# Altium schematic sheet Input.SchDoc: Input
size A; DrawnBy: Austin Hendrix
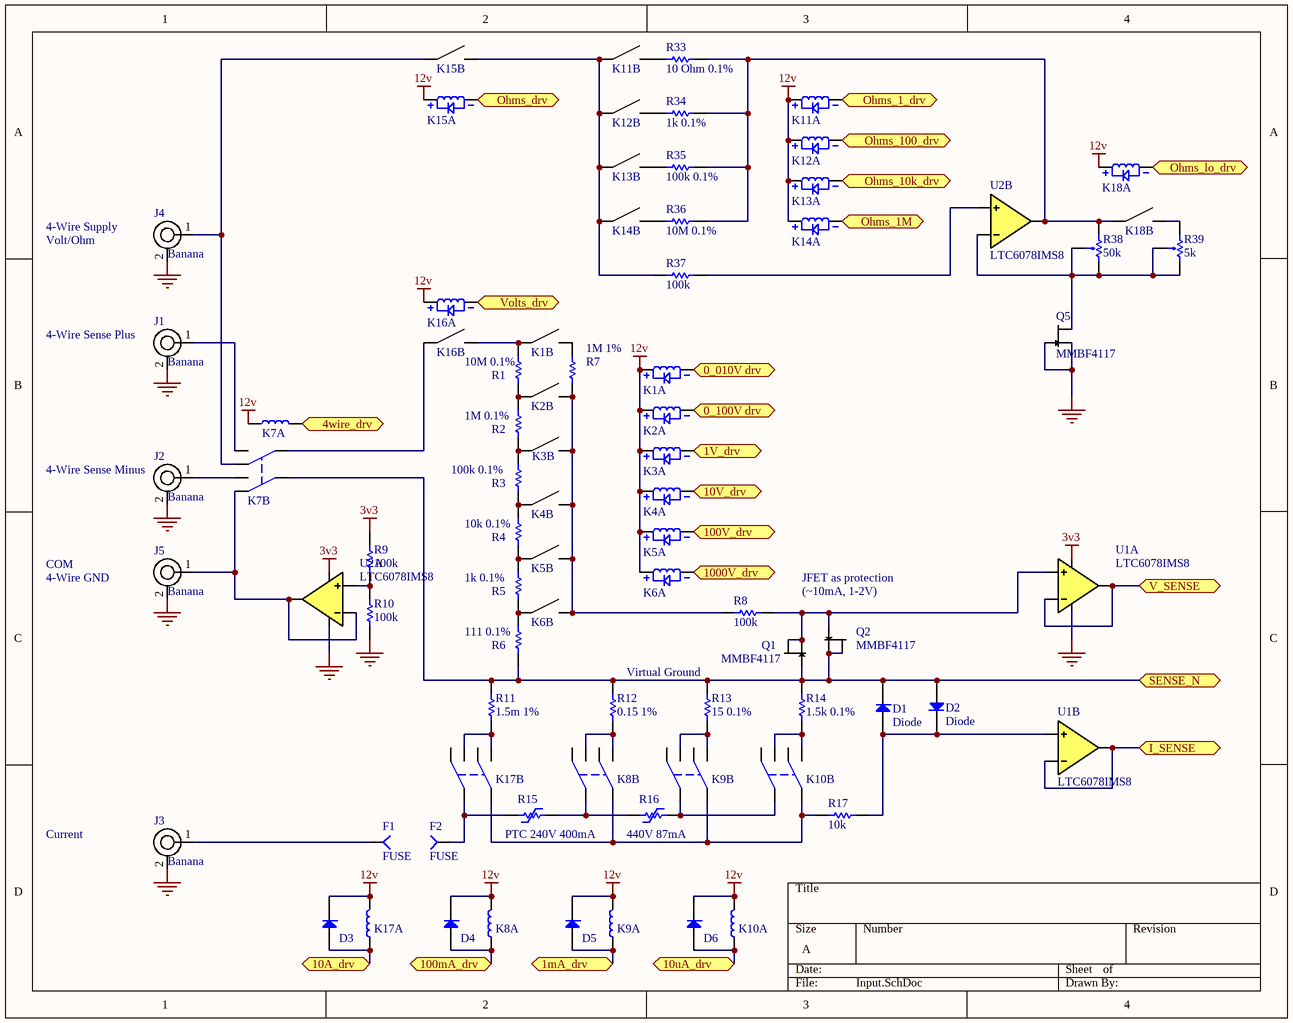
[diagram p0: Input.SchDoc]

## Parts
D1  Diode  [SOD80]
D2  Diode  [SOD80]
D3  Diode  [SOD80]  (value not drawn)
D4  Diode  [SOD80]  (value not drawn)
D5  Diode  [SOD80]  (value not drawn)
D6  Diode  [SOD80]  (value not drawn)
F1  FUSE  [FUSE CLIP]
F2  FUSE  [FUSE CLIP]
J1  Banana  [FCR7350]
J2  Banana  [FCR7350]
J3  Banana  [FCR7350]
J4  Banana  [FCR7350]
J5  Banana  [FCR7350]
K1  Relay Reed SPST 1000V / 500mA 12V  [Coto 9104-12-11]  (value not drawn)  (parts A,B of 2)
K2  Relay Reed SPST 500mA 12V  [HE3621A]  (value not drawn)  (parts A,B of 2)
K3  Relay Reed SPST 500mA 12V  [HE3621A]  (value not drawn)  (parts A,B of 2)
K4  Relay Reed SPST 500mA 12V  [HE3621A]  (value not drawn)  (parts A,B of 2)
K5  Relay Reed SPST 500mA 12V  [HE3621A]  (value not drawn)  (parts A,B of 2)
K6  Relay Reed SPST 500mA 12V  [HE3621A]  (value not drawn)  (parts A,B of 2)
K7  Relay DPDT 15A 12V  [K10-pcb]  (value not drawn)  (parts A,B of 2)
K8  Relay DPDT 2A 12V  [EE2-12NU]  (value not drawn)  (parts A,B of 2)
K9  Relay DPDT 2A 12V  [EE2-12NU]  (value not drawn)  (parts A,B of 2)
K10  Relay DPDT 2A 12V  [EE2-12NU]  (value not drawn)  (parts A,B of 2)
K11  Relay Reed SPST 500mA 12V  [HE3621A]  (value not drawn)  (parts A,B of 2)
K12  Relay Reed SPST 500mA 12V  [HE3621A]  (value not drawn)  (parts A,B of 2)
K13  Relay Reed SPST 500mA 12V  [HE3621A]  (value not drawn)  (parts A,B of 2)
K14  Relay Reed SPST 500mA 12V  [HE3621A]  (value not drawn)  (parts A,B of 2)
K15  Relay Reed SPST 500mA 12V  [HE3621A]  (value not drawn)  (parts A,B of 2)
K16  Relay Reed SPST 1000V / 500mA 12V  [Coto 9104-12-11]  (value not drawn)  (parts A,B of 2)
K17  Relay DPDT 15A 12V  [K10-pcb]  (value not drawn)  (parts A,B of 2)
K18  Relay Reed SPST 500mA 12V  [HE3621A]  (value not drawn)  (parts A,B of 2)
Q1  MMBF4117  [SOT_23]
Q2  MMBF4117  [SOT_23]
Q5  MMBF4117  [SOT_23]
R1  10M 0.1%  [R2010]
R2  1M 0.1%  [R1206]
R3  100k 0.1%  [R0805]
R4  10k 0.1%  [R0603]
R5  1k 0.1%  [R0603]
R6  111 0.1%  [R0402]
R7  1M 1%  [R2512]
R8  100k  [R0603]
R9  100k  [R0603]
R10  100k  [R0603]
R11  1.5m 1%  [R2512]
R12  0.15 1%  [R2010]
R13  15 0.1%  [R0805]
R14  1.5k 0.1%  [R0603]
R15  PTC 240V 400mA  [0ZRE0040FF1A]
R16  440V 87mA  [B59751C0120A070]
R17  10k  [R0603]
R33  10 Ohm 0.1%  [R0603]
R34  1k 0.1%  [R0603]
R35  100k 0.1%  [R0805]
R36  10M 0.1%  [R1206]
R37  100k  [R0603]
R38  50k  [PV36]
R39  5k  [PV36]
U1  LTC6078IMS8  [8MSOP]  (parts A,B of 2)
U2  LTC6078IMS8  [8MSOP]  (parts A,B of 2)

## Ports
0_010V drv, 0_100V drv, 1mA_drv, 1V_drv, 4wire_drv, 10A_drv, 10uA_drv, 10V_drv, 100mA_drv, 100V_drv, 1000V_drv, I_SENSE, Ohms_1_drv, Ohms_1M, Ohms_10k_drv, Ohms_100_drv, Ohms_drv, Ohms_lo_drv, SENSE_N, V_SENSE, Volts_drv

## Nets
3v3: R9.2 U1.8 U2.8
12v: D3.2(K) D4.2(K) D5.2(K) D6.2(K) K1.3 K2.2 K3.2 K4.2 K5.2 K6.2 K7.7 K8.12 K9.12 K10.12 K11.2 K12.2 K13.2 K14.2 K15.2 K16.3 K17.8 K18.2
GND: J1.2 J2.2 J3.2 J4.2 J5.2 Q5.1 Q5.3 R10.1 U1.4 U2.4
0_010V drv: K1.5 ; port 0_010V drv
0_100V drv: K2.3 ; port 0_100V drv
1mA_drv: D5.1(A) K9.1 ; port 1mA_drv
1V_drv: K3.3 ; port 1V_drv
4wire_drv: K7.8 ; port 4wire_drv
10A_drv: D3.1(A) K17.7 ; port 10A_drv
10uA_drv: D6.1(A) K10.1 ; port 10uA_drv
10V_drv: K4.3 ; port 10V_drv
100mA_drv: D4.1(A) K8.1 ; port 100mA_drv
100V_drv: K5.3 ; port 100V_drv
1000V_drv: K6.3 ; port 1000V_drv
I_SENSE: U1.6 U1.7 ; port I_SENSE
Ohms_1_drv: K11.3 ; port Ohms_1_drv
Ohms_1M: K14.3 ; port Ohms_1M
Ohms_10k_drv: K13.3 ; port Ohms_10k_drv
Ohms_100_drv: K12.3 ; port Ohms_100_drv
Ohms_drv: K15.3 ; port Ohms_drv
Ohms_lo_drv: K18.3 ; port Ohms_lo_drv
SENSE_N: D1.2(K) D2.1(A) K7.6 Q1.3 Q2.1 Q2.2 R6.1 R11.2 R12.2 R13.2 R14.2 ; port SENSE_N
V_SENSE: U1.1 U1.2 ; port V_SENSE
Volts_drv: K16.5 ; port Volts_drv
NetD1_1: D1.1(A) D2.2(K) R17.2 U1.5
NetF1_1: F1.1 J3.1
NetF2_1: F2.1 K17.6 R15.1
NetJ1_1: J1.1 K7.3
NetJ2_1: J2.1 K7.4
NetJ4_1: J4.1 K7.1 K15.1
NetJ5_1: J5.1 K7.2 U2.1 U2.2
NetK1_1: K1.1 K16.7 R1.2
NetK1_7: K1.7 R7.2
NetK2_1: K2.1 R1.1 R2.2
NetK2_4: K2.4 K3.4 K4.4 K5.4 K6.4 R7.1 R8.1
NetK3_1: K3.1 R2.1 R3.2
NetK4_1: K4.1 R3.1 R4.2
NetK5_1: K5.1 R4.1 R5.2
NetK6_1: K6.1 R5.1 R6.2
NetK7_5: K7.5 K16.1
NetK8_4: K8.4 R15.2 R16.1
NetK8_5: K8.5 K8.8 R12.1
NetK8_9: K8.9 K9.9 K10.9 K17.5 R17.1
NetK9_4: K9.4 K10.4 R16.2
NetK9_5: K9.5 K9.8 R13.1
NetK10_5: K10.5 K10.8 R14.1
NetK11_1: K11.1 K12.1 K13.1 K14.1 K15.4 R37.1
NetK11_4: K11.4 R33.1
NetK12_4: K12.4 R34.1
NetK13_4: K13.4 R35.1
NetK14_4: K14.4 R36.1
NetK17_3: K17.3 K17.4 R11.1
NetK18_1: K18.1 R33.2 R34.2 R35.2 R36.2 R38.3 U2.7
NetK18_4: K18.4 R39.3
NetQ1_1: Q1.1 Q1.2 Q2.3 R8.2 U1.3
NetQ5_2: Q5.2 R38.1 R38.2 R39.1 R39.2 U2.6
NetR9_1: R9.1 R10.2 U2.3
NetR37_2: R37.2 U2.5

Not connected (* = marked no-connect by the designer): K8 3 10; K9 3 10; K10 3 10; K17 1 2

## Notes on the sheet
- (near J4) 4-Wire Supply
- Volt/Ohm
- (near J1) 4-Wire Sense Plus
- (near J2) 4-Wire Sense Minus
- COM
- 4-Wire GND
- JFET as protection
- (~10mA, 1-2V)
- Virtual Ground
- Current

## Library data of the parts
D1 D2 = Diode 125V 200mA: DIODE GEN PURP 125V 200MA LL34; Supplier 1: Digi-Key; Supplier Part Number 1: FDLL3595CT-ND
D3-D6 = Diode 100V 200mA: DIODE GEN PURP 100V 200MA LL34; Supplier 1: Digi-Key; Supplier Part Number 1: FDLL4148CT-ND
F1 F2 = FUSE CLIP: FUSE CLIP CARTRIDGE 30A PCB; Supplier 1: Digi-Key; Supplier Part Number 1: 36-3566-ND
J1-J5 = Banana Jack: SOCKET, PCB, 4MM, R/A, S16N-PC, YEL; Supplier 1: Newark; Supplier Part Number 1: 20T2058; Supplier 2: Newark; Supplier Part Number 2: 20T2059; Supplier 3: Newark; Supplier Part Number 3: 20T2055
K1 K16 = Relay Reed SPST 1000V / 500mA 12V: RELAY REED SPST 500MA 12V; Supplier 1: Digi-Key; Supplier Part Number 1: 306-1196-ND
K7 K17 = Relay DPDT 15A 12V: RELAY GEN PURPOSE DPDT 15A 12V; Supplier 1: Digi-Key; Supplier Part Number 1: PB327-ND
K8-K10 = Relay DPDT 2A 12V: RELAY GEN PURPOSE DPDT 2A 12V; Supplier 1: Digi-Key; Supplier Part Number 1: 399-11033-5-ND
Q1 Q2 Q5 = MMBF4117: JFET N-CH 40V 0.225W SOT23; Supplier 1: Digi-Key; Supplier Part Number 1: MMBF4117CT-ND
R1 = 10M 2010 0.1%: RES SMD 10M OHM 0.1% 1W 2010; Supplier 1: Digi-Key; Supplier Part Number 1: HVCB2010BDE10M0CT-ND
R2 = 1M 1206 0.1%: RES SMD 1M OHM 0.1% 1/4W 1206; Supplier 1: Digi-Key; Supplier Part Number 1: YAG5104CT-ND
R3 R35 = 100k 0805 0.1%: RES SMD 100K OHM 0.1% 1/8W 0805; Supplier 1: Digi-Key; Supplier Part Number 1: YAG2326CT-ND
R4 = 10k 0603 0.1%: RES SMD 10K OHM 0.1% 1/10W 0603; Supplier 1: Digi-Key; Supplier Part Number 1: YAG2313CT-ND
R5 R34 = 1k 0603 0.1%: RES SMD 1K OHM 0.1% 1/10W 0603; Supplier 1: Digi-Key; Supplier Part Number 1: YAG2314CT-ND
R6 = 111 0402 0.1%: RES 111 OHM 0.1% 1/10W 0402; Supplier 1: Digi-Key; Supplier Part Number 1: 541-2065-1-ND
R7 = 1M 2512 1%: CHV2512-FX-1004ELF; Supplier 1: Digi-Key; Supplier Part Number 1: CHV2512-FX-1004ELFCT-ND
R8-R10 R37 = 100k 0603 5%: RES SMD 100K OHM 5% 1/10W 0603; Supplier 1: Digi-Key; Supplier Part Number 1: 311-100KGRCT-ND
R11 = 1.5m 2512 1%: RES 0.0015 OHM 1% 3W 2512; Supplier 1: Digi-Key; Supplier Part Number 1: 696-1184-1-ND
R12 = 0.15 2010 1%: RES 0.15 OHM 1% 1W 2010; Supplier 1: Digi-Key; Supplier Part Number 1: CSR2010FTR150CT-ND
R13 = 15 0805 0.1%: RES SMD 15 OHM 0.1% 1/8W 0805; Supplier 1: Digi-Key; Supplier Part Number 1: YAG4833CT-ND
R14 = 1.5k 0603 0.1%: RES SMD 1.5K OHM 0.1% 1/5W 0603; Supplier 1: Digi-Key; Supplier Part Number 1: P19990CT-ND
R15 = PTC 240V 400mA: PTC RESET FUSE 240V 400MA RADIAL; Supplier 1: Digi-Key; Supplier Part Number 1: 507-1354-ND
R16 = PTC 440V 87mA: PTC RESET FUSE 440V 87MA RADIAL; Supplier 1: Digi-Key; Supplier Part Number 1: 495-7219-ND
R17 = 10k 0603 5%: RES SMD 10K OHM 5% 1/10W 0603; Supplier 1: Digi-Key; Supplier Part Number 1: 311-10KGRCT-ND
R33 = 10 Ohm 0603 0.1%: RES SMD 10 OHM 0.1% 1/10W 0603; Supplier 1: Digi-Key; Supplier Part Number 1: YAG3350CT-ND
R36 = 10M 1206 0.1%: RES 10M OHM 0.1% 1/3W 1206; Supplier 1: Digi-Key; Supplier Part Number 1: HVCB1206BDE10M0CT-ND
R38 = TRIMMER 50K: TRIMMER 50K OHM 0.5W TH; Supplier 1: Digi-Key; Supplier Part Number 1: 490-2889-ND
R39 = TRIMMER 5K: TRIMMER 5K OHM 0.5W TH; Supplier 1: Digi-Key; Supplier Part Number 1: 490-2888-ND
K2-K6 K11-K15 K18 = Relay Reed SPST 500mA 12V: Supplier 1: Digi-Key; Supplier Part Number 1: HE209-ND
U1 U2 = LTC6078IMS8: Supplier 1: Digi-Key; Supplier Part Number 1: LTC6078IMS8#PBF-ND